# EAGLE design buck_converter (EAGLE 9.6.2)
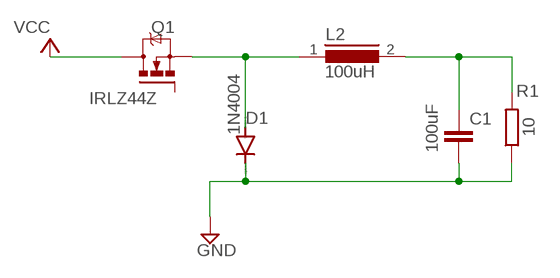
[diagram p0: schematic, sheet 1]

## Parts
C1  100uF  C7.5/3  [C7.5B3]
D1  1N4004  [DO41-10]
L2  100uH  82114R  [82114R]
Q1  IRLZ44Z  [TO220BH]
R1  10  R-EU_R0805  [R0805]

## Nets
GND: C1.2 D1.C R1.1
N$1: D1.A L2.1 Q1.S
N$2: C1.1 L2.2 R1.2
VCC: Q1.D
Unconnected: Q1.G

## Library data of the parts
C1 = capacitor-wima:C: CAPACITOR naming: grid - package width
D1 = diode:1N4004: DIODE general purpose rectifier, 1 A
L2 = inductors:82114R: INDUCTOR; SPICEPREFIX: L
Q1 = transistor-power:IRLZ44Z: N-Channel HEXFET® Power MOSFET Logic Level AUTOMOTIVE MOSFET Source: http://www.irf.com/product-info/datasheets/data/irlz44zpbf.pdf
R1 = rcl:R-EU_: RESISTOR, European symbol; SPICEPREFIX: R

## Board
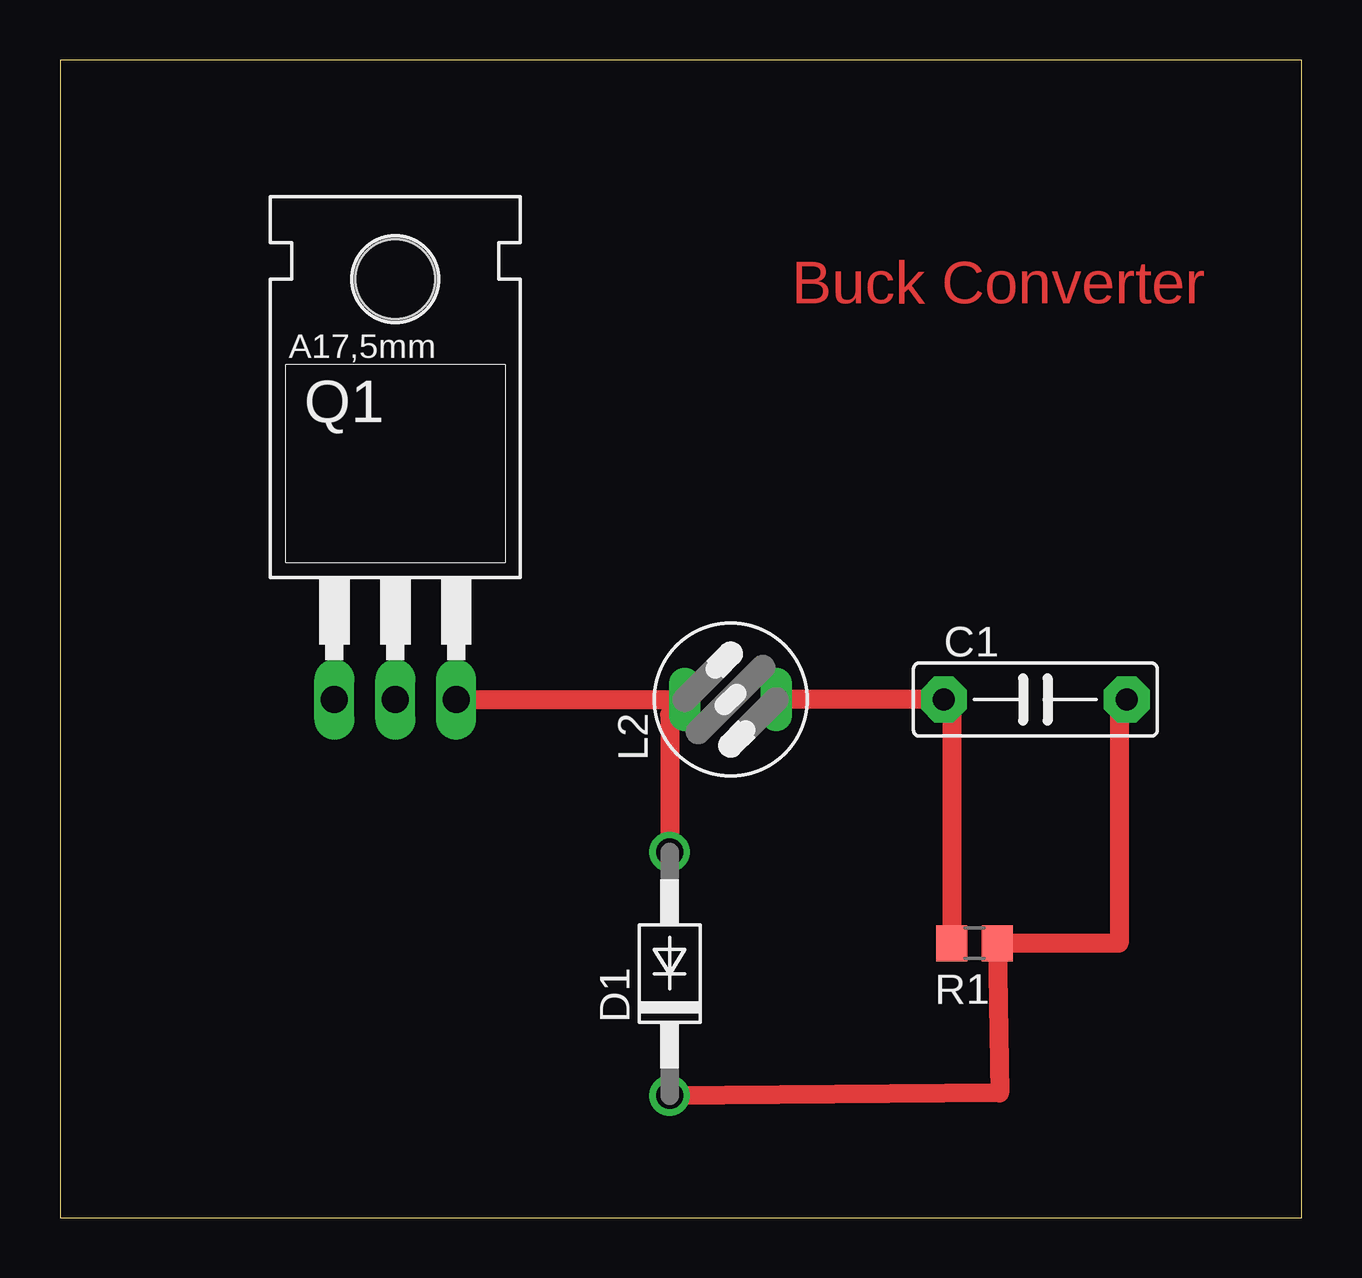
[diagram p1: board, top side]
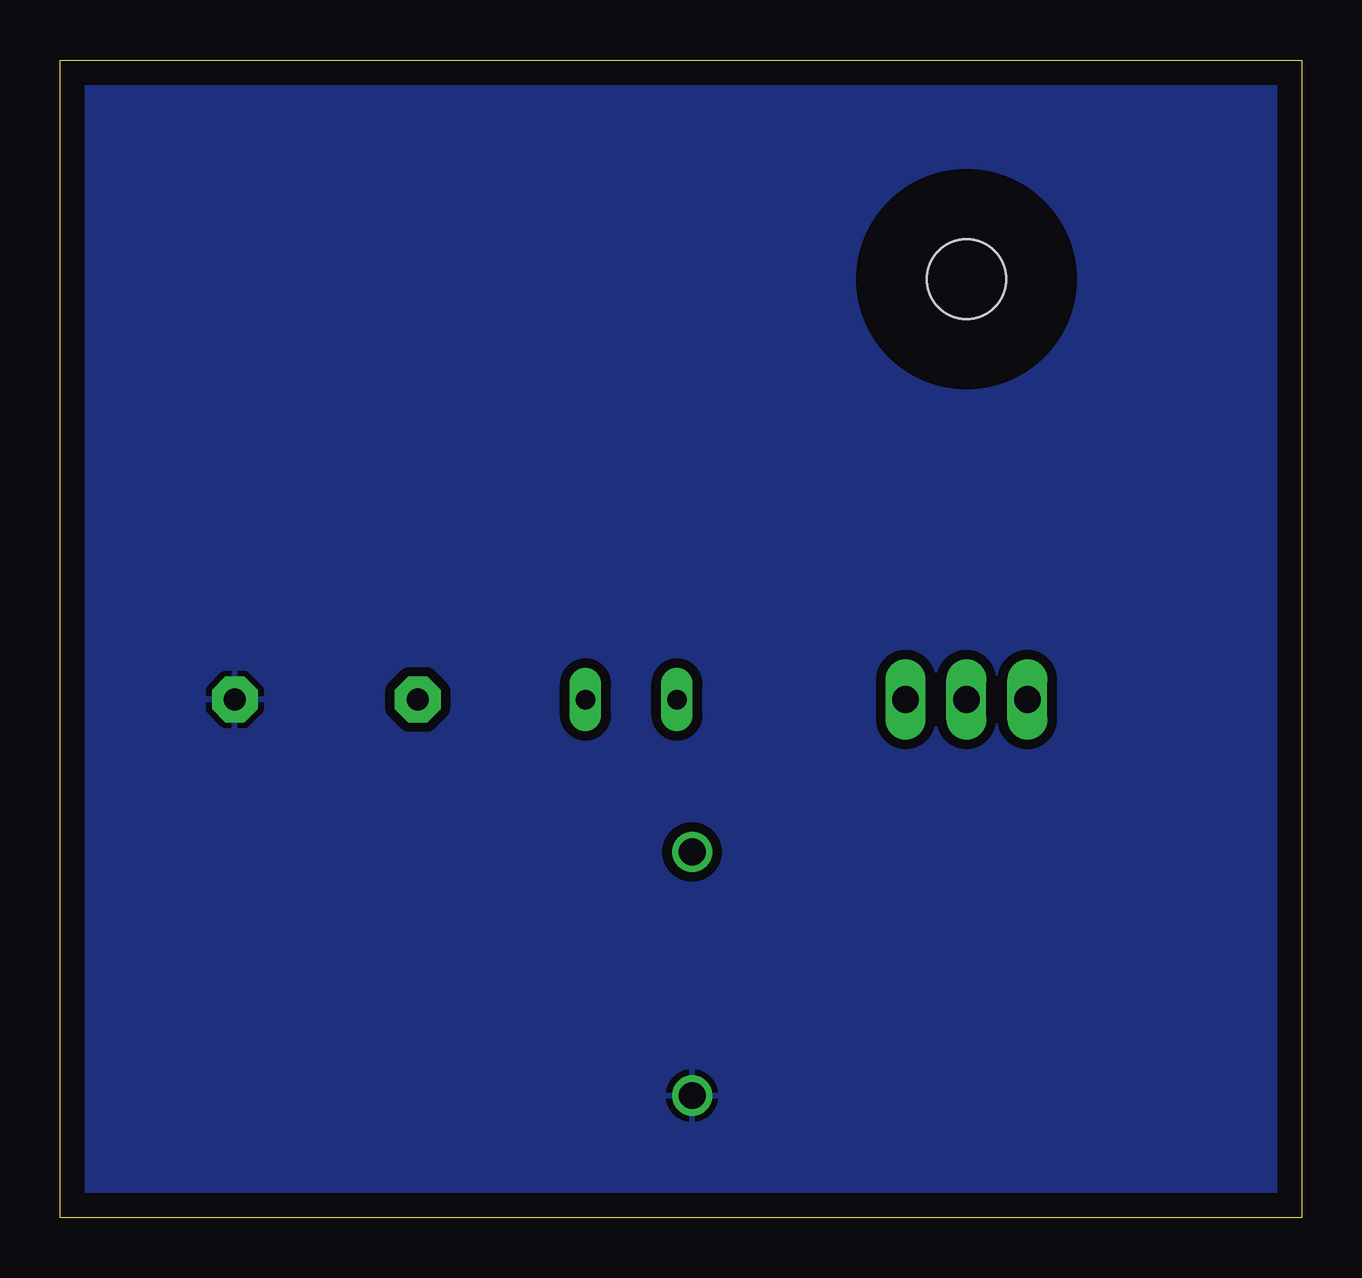
[diagram p2: board, bottom side, seen from below]

Size 51.74 x 48.25 mm. Coordinates in mm from the lower left corner, seen from the top.
Outline: 0,0 51.74,0 51.74,48.25 0,48.25 0,0
Copper layers (1*16): Top 0.035mm / dielectric 1.5mm / Bottom 0.035mm
Design rules "default": minimum track width 6mil, minimum drill 0.35mm, track to track 6mil, track to pad 6mil, pad to pad 6mil, via to via 6mil, smd to smd 6mil, copper to edge 40mil, drill to drill 6mil, minimum pad ring 10mil, minimum via ring 8mil, stop-mask expansion 4mil, vias tented up to drill 0mil, thermal gap 10mil

### Footprints (pad centres in the part's own frame; a part is rotated, then mirrored left to right if it is on the bottom)
C7.5B3 = drill 0.914 pad 1.905 octagon: 1 -3.81,0; 2 3.81,0
DO41-10 = drill 1.118: A 5.08,0; C -5.08,0
82114R = drill 0.813 long: 1 0,1.905; 2 0,-1.905
TO220BH = drill 1.118 long: D 0,-6.35; G -2.54,-6.35; S 2.54,-6.35 | hole 3.302: 0,11.176
R0805 = smd 1.3 x 1.5: 1 -0.95,0; 2 0.95,0

### Placement (x,y rotation side)
C1  40.64,21.59 0 top
D1  25.4,10.16 90 top
L2  27.94,21.59 90 top
Q1  13.97,27.94 0 top
R1  38.1,11.43 180 top

### Tracks (layer width: path | path; a pad name or v marks a point on that pad's centre or on a via)
GND
  Top 0.152: C1.2 44.13,21.27
  Top 0.8: 44.13,21.27 44.13,11.43 R1.1 39.16,5.2 D1.C
  pour Bottom (isolate 0.4, rank 2): 0,48.26 0,0 1.27,0 52.07,0 52.07,48.26 50.8,48.26
N$1
  Top 0.152: L2.1 25.4,20.95
  Top 0.8: Q1.S L2.1 | 25.4,20.95 D1.A
N$2
  Top 0.152: C1.1 37.15,21.27
  Top 0.8: 37.15,21.27 R1.2 | C1.1 L2.2

### Text on the board
Top: Buck Converter